# Altium project RP2040.PrjPcb
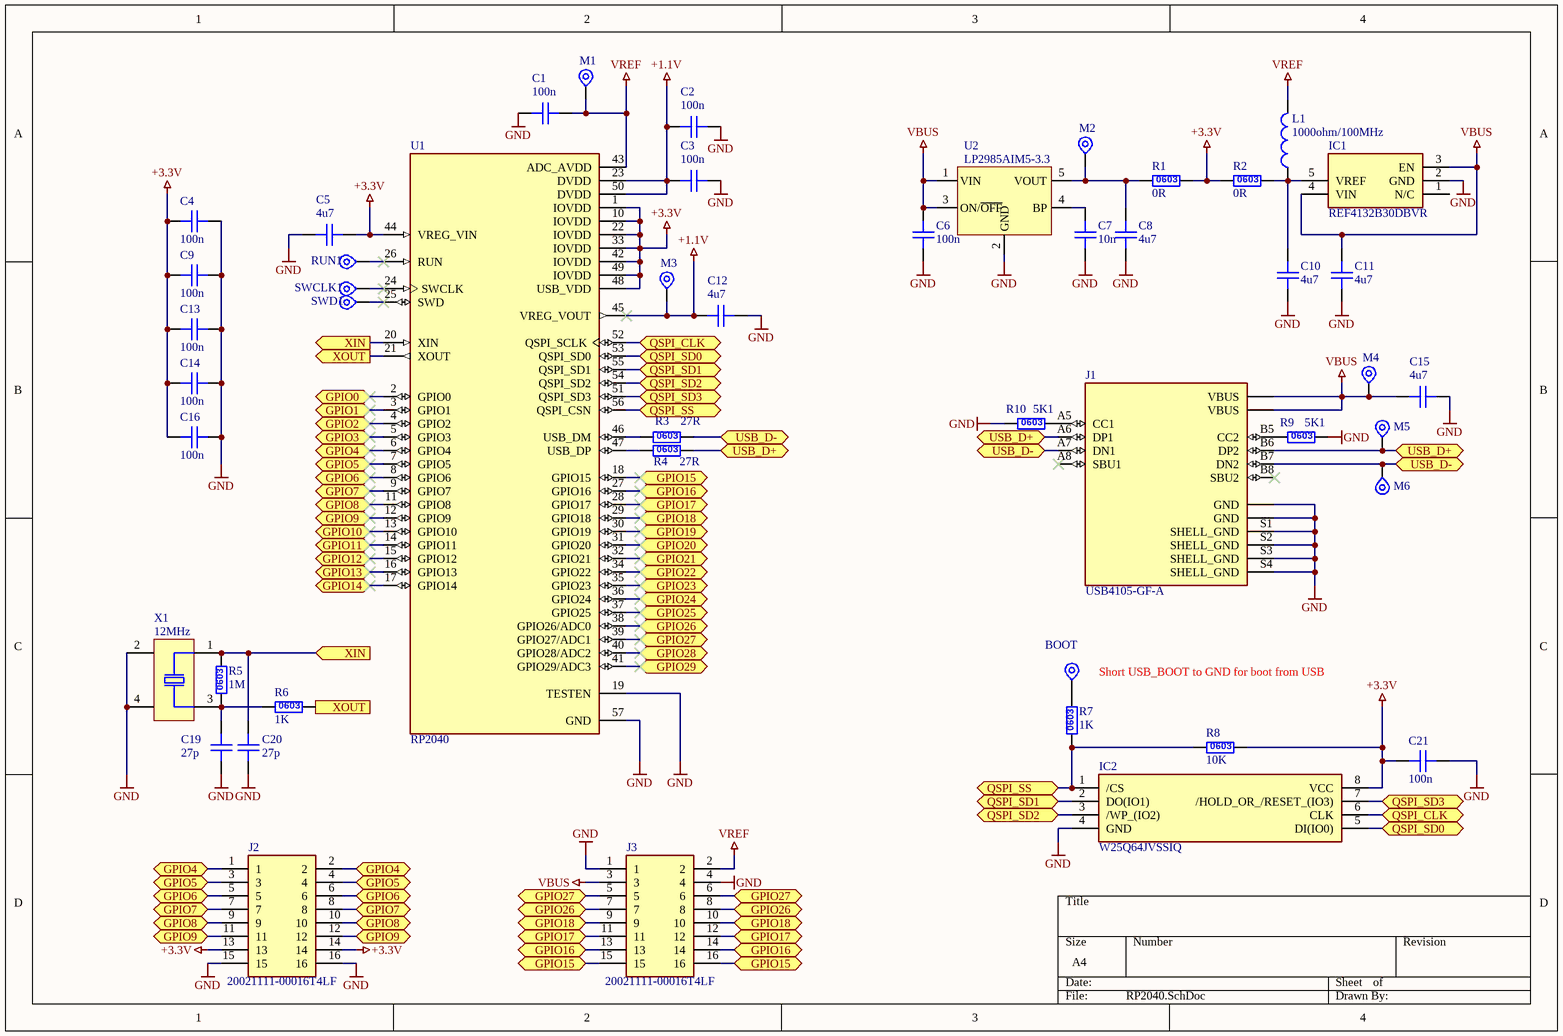
[diagram p0: RP2040.SchDoc]
=Title: RP2040
1 sheet, 48 parts. Net scope: flat (ports and power ports of the same name join across sheets).
Board file: RP2040.PcbDoc

## Sheet RP2040.SchDoc
size A4; SheetNumber: 1; SheetTotal: 1

### Parts
BOOT  TP  [Pad0.6mm]  (value not drawn)  (no BOM)
C1  100n  [C0603M]
C2  100n  [C0603M]
C3  100n  [C0603M]
C4  100n  [C0603M]
C5  4u7  [C0603]
C6  100n  [C0603M]
C7  10n  [C0603M]
C8  4u7  [C0603]
C9  100n  [C0603M]
C10  4u7  [C0603]
C11  4u7  [C0603]
C12  4u7  [C0603]
C13  100n  [C0603M]
C14  100n  [C0603M]
C15  4u7  [C0603]
C16  100n  [C0603M]
C19  27p  [C0603M]
C20  27p  [C0603M]
C21  100n  [C0603M]
IC1  REF4132B30DBVR  [SOT95P280X145-5N]
IC2  W25Q64JVSSIQ  [SOIC127P790X216-8N]
J1  USB4105-GF-A  [GCT_USB4105-GF-A]
J2  20021111-00016T4LF  [2002111100016T4LF]
J3  20021111-00016T4LF  [2002111100016T4LF]
L1  1000ohm/100MHz  [L0805M]
M1  TP  [Pad 1mm SMD]  (value not drawn)  (no BOM)
M2  TP  [Pad 1mm SMD]  (value not drawn)  (no BOM)
M3  TP  [Pad 1mm SMD]  (value not drawn)  (no BOM)
M4  TP  [Pad 1mm SMD]  (value not drawn)  (no BOM)
M5  TP  [Pad 1mm SMD]  (value not drawn)  (no BOM)
M6  TP  [Pad 1mm SMD]  (value not drawn)  (no BOM)
R1  0R  [R0603]
R2  0R  [R0603]
R3  27R  [R0603]
R4  27R  [R0603]
R5  1M  [R0603]
R6  1K  [R0603]
R7  1K  [R0603]
R8  10K  [R0603]
R9  5K1  [R0603]
R10  5K1  [R0603]
RUN1  TP  [Pad0.6mm]  (value not drawn)  (no BOM)
SWCLK1  TP  [Pad0.6mm]  (value not drawn)  (no BOM)
SWD1  TP  [Pad0.6mm]  (value not drawn)  (no BOM)
U1  RP2040  [QFN40P700X700X90-57N]
U2  LP2985AIM5-3.3  [SOT23-5]
X1  12MHz  [XTAL_SMD_5032_4PIN]

### Ports
GPIO0 (bidir), GPIO1 (bidir), GPIO2 (bidir), GPIO3 (bidir), GPIO4 (bidir), GPIO5 (bidir), GPIO6 (bidir), GPIO7 (bidir), GPIO8 (bidir), GPIO9 (bidir), GPIO10 (bidir), GPIO11 (bidir), GPIO12 (bidir), GPIO13 (bidir), GPIO14 (bidir), GPIO15 (bidir), GPIO16 (bidir), GPIO17 (bidir), GPIO18 (bidir), GPIO19 (bidir), GPIO20 (bidir), GPIO21 (bidir), GPIO22 (bidir), GPIO23 (bidir), GPIO24 (bidir), GPIO25 (bidir), GPIO26 (bidir), GPIO27 (bidir), GPIO28 (bidir), GPIO29 (bidir), QSPI_CLK (bidir), QSPI_SD0 (bidir), QSPI_SD1 (bidir), QSPI_SD2 (bidir), QSPI_SD3 (bidir), QSPI_SS (bidir), USB_D+ (bidir), USB_D- (bidir), XIN (in), XIN (out), XOUT (out)

### Nets
+1.1V: C2.1 C3.1 C12.1 M3.1 U1.23(DVDD) U1.45(VREG_VOUT) U1.50(DVDD)
+3.3V: C4.2 C5.2 C9.2 C13.2 C14.2 C16.2 C21.1 IC2.8(VCC) J2.13 J2.14 R1.1 R2.2 R8.1 U1.1(IOVDD) U1.10(IOVDD) U1.22(IOVDD) U1.33(IOVDD) U1.42(IOVDD) U1.44(VREG_VIN) U1.48(USB_VDD) U1.49(IOVDD)
GND: C1.2 C2.2 C3.2 C4.1 C5.1 C6.2 C7.2 C8.2 C9.1 C10.2 C11.2 C12.2 C13.1 C14.1 C15.2 C16.1 C19.2 C20.2 C21.2 IC1.2(GND) IC2.4(GND) J1.A1_B12(GND) J1.B1_A12(GND) J1.S1(SHELL_GND) J1.S2(SHELL_GND) J1.S3(SHELL_GND) J1.S4(SHELL_GND) J2.15 J2.16 J3.1 J3.4 R9.1 R10.2 U1.19(TESTEN) U1.57(GND) U2.2(GND) X1.2(Add2) X1.4(Add4)
VBUS: C6.1 C11.1 C15.1 IC1.3(EN) IC1.4(VIN) J1.A4_B9(VBUS) J1.B4_A9(VBUS) J3.3 M4.1 U2.1(VIN) U2.3(ON/~{OFF})
VREF: C1.1 J3.2 L1.2 M1.1 U1.43(ADC_AVDD)
NetBOOT_1: BOOT.1 R7.1
NetC7_1: C7.1 U2.4(BP)
NetC8_1: C8.1 M2.1 R1.2 U2.5(VOUT)
NetC10_1: C10.1 IC1.5(VREF) L1.1 R2.1
NetC19_1: C19.1 R5.2 R6.2 X1.3(Osc3)
NetC20_1: C20.1 R5.1 U1.20(XIN) X1.1(Osc1) ; port XIN
NetIC2_1: IC2.1(/CS) R7.2 R8.2 U1.56(QSPI_CSN) ; port QSPI_SS
NetIC2_2: IC2.2(DO(IO1)) U1.55(QSPI_SD1) ; port QSPI_SD1
NetIC2_3: IC2.3(/WP_(IO2)) U1.54(QSPI_SD2) ; port QSPI_SD2
NetIC2_5: IC2.5(DI(IO0)) U1.53(QSPI_SD0) ; port QSPI_SD0
NetIC2_6: IC2.6(CLK) U1.52(QSPI_SCLK) ; port QSPI_CLK
NetIC2_7: IC2.7(/HOLD_OR_/RESET_(IO3)) U1.51(QSPI_SD3) ; port QSPI_SD3
NetJ1_A5: J1.A5(CC1) R10.1
NetJ1_A6: J1.A6(DP1) J1.B6(DP2) M5.1 R4.1 ; port USB_D+
NetJ1_A7: J1.A7(DN1) J1.B7(DN2) M6.1 R3.1 ; port USB_D-
NetJ1_B5: J1.B5(CC2) R9.2
NetJ2_1: J2.1 J2.2 U1.6(GPIO4) ; port GPIO4
NetJ2_3: J2.3 J2.4 U1.7(GPIO5) ; port GPIO5
NetJ2_5: J2.5 J2.6 U1.8(GPIO6) ; port GPIO6
NetJ2_7: J2.7 J2.8 U1.9(GPIO7) ; port GPIO7
NetJ2_9: J2.9 J2.10 U1.11(GPIO8) ; port GPIO8
NetJ2_11: J2.11 J2.12 U1.12(GPIO9) ; port GPIO9
NetJ3_5: J3.5 J3.6 U1.39(GPIO27/ADC1) ; port GPIO27
NetJ3_7: J3.7 J3.8 U1.38(GPIO26/ADC0) ; port GPIO26
NetJ3_9: J3.9 J3.10 U1.29(GPIO18) ; port GPIO18
NetJ3_11: J3.11 J3.12 U1.28(GPIO17) ; port GPIO17
NetJ3_13: J3.13 J3.14 U1.27(GPIO16) ; port GPIO16
NetJ3_15: J3.15 J3.16 U1.18(GPIO15) ; port GPIO15
NetR3_2: R3.2 U1.46(USB_DM)
NetR4_2: R4.2 U1.47(USB_DP)
NetR6_1: R6.1 U1.21(XOUT) ; port XOUT
NetRUN1_1: RUN1.1 U1.26(RUN)
NetSWCLK1_1: SWCLK1.1 U1.24(SWCLK)
NetSWD1_1: SWD1.1 U1.25(SWD)
NetU1_2: U1.2(GPIO0) ; port GPIO0
NetU1_3: U1.3(GPIO1) ; port GPIO1
NetU1_4: U1.4(GPIO2) ; port GPIO2
NetU1_5: U1.5(GPIO3) ; port GPIO3
NetU1_13: U1.13(GPIO10) ; port GPIO10
NetU1_14: U1.14(GPIO11) ; port GPIO11
NetU1_15: U1.15(GPIO12) ; port GPIO12
NetU1_16: U1.16(GPIO13) ; port GPIO13
NetU1_17: U1.17(GPIO14) ; port GPIO14
NetU1_30: U1.30(GPIO19) ; port GPIO19
NetU1_31: U1.31(GPIO20) ; port GPIO20
NetU1_32: U1.32(GPIO21) ; port GPIO21
NetU1_34: U1.34(GPIO22) ; port GPIO22
NetU1_35: U1.35(GPIO23) ; port GPIO23
NetU1_36: U1.36(GPIO24) ; port GPIO24
NetU1_37: U1.37(GPIO25) ; port GPIO25
NetU1_40: U1.40(GPIO28/ADC2) ; port GPIO28
NetU1_41: U1.41(GPIO29/ADC3) ; port GPIO29

Not connected (* = marked no-connect by the designer): IC1 1(N/C); J1 A8(SBU1)* B8(SBU2)*

### Notes on the sheet
- Short USB_BOOT to GND for boot from USB
- (in symbol CMP-UN-002043-2) 0603
- (in symbol UniversalResistor) 0603

### Library data of the parts
BOOT M1-M6 RUN1 SWCLK1 SWD1 = M Point: Test Point; Main: Mechanical; Category: Pads_Pins_Measure_Points; Stock number: --------
C1-C4 C6 C9 C13 C14 C16 C21 = UniversalCapacitor: Ceramic Capacitor X7R; Manufacturer: VISHAY; Part Number: 100n/16V X7R C0603; Main: Capacitors; SMD/THD: SMD; Value: 100n/16V; Stock number: 10003450; Category: Capacitors CERA SMD; Status: X
C5 C10-C12 C15 = UniversalCapacitor: Ceramic Capacitor X5R; Part Number: GRM188R60J475KE19J; Manufacturer: Murata; Value: 4u7/6,3V; SMD/THD: SMD; Main: Capacitors; Category: Capacitors CERA SMD; Stock number: 10006168; Status: T; ComponentLink1URL: http://datasheet.octopart.com/GRM188R60J475KE19J-Murata-datasheet-14401031.pdf; ComponentLink1Description: Datasheet
C7 = UniversalCapacitor: Ceramic Capacitor X7R; Manufacturer: VISHAY; Part Number: 10n/50V X7R C0603; SMD/THD: SMD; Main: Capacitors; Status: A; Stock number: 10002497; Category: Capacitors CERA SMD; Value: 10n
C8 = CMP-UN-000401-1: Ceramic Capacitor X5R; Part Number: GRM188R60J475KE19J; Manufacturer: Murata; Value: 4u7/6,3V; SMD/THD: SMD; Main: Capacitors; Category: Capacitors CERA SMD; Stock number: 10006168; Status: T; ComponentLink1URL: http://datasheet.octopart.com/GRM188R60J475KE19J-Murata-datasheet-14401031.pdf; ComponentLink1Description: Datasheet
C19 C20 = UniversalCapacitor: Ceramic Capacitor NPO; Manufacturer: VISHAY; Part Number: 22p/50V NPO C0603; Main: Capacitors; SMD/THD: SMD; Value: 22p; Stock number: 10004609; Status: A; Category: Capacitors CERA SMD
IC1 = REF4132B30DBVR: Integrated Circuit; Manufacturer_Name: Texas Instruments; Datasheet Link: https://www.ti.com/lit/ds/symlink/ref4132.pdf?ts=1621337373445&ref_url=https%253A%252F%252Fwww.ti.com%252Fstore%252Fti%252Fen%252Fp%252Fproduct%252F%253Fp%253DREF4132B33DBVR; Height: 1.45mm; Manufacturer_Part_Number: REF4132B30DBVR
IC2 = W25Q64JVSSIQ: Integrated Circuit; Manufacturer_Name: Winbond; Datasheet Link: https://componentsearchengine.com//W25Q64JVSSIQ.pdf; Height: 2.16mm; Mouser2 Part Number: 454-W25Q64JVSSIQ; Mouser2 Price/Stock: https://www.mouser.com/Search/Refine.aspx?Keyword=454-W25Q64JVSSIQ; Manufacturer_Part_Number: W25Q64JVSSIQ
J1 = USB4105-GF-A: USB-C (USB TYPE-C) USB 2.0 Receptacle Connector 24 (16+8 Dummy) Position Surface Mount, Right Angle; Through Hole; MF: GCT; Price: None; Value: *; MP: USB4105-GF-A; Package: None; Purchase-URL: https://pricing.snapeda.com/search/part/USB4105-GF-A/?ref=eda; SnapEDA_Link: https://www.snapeda.com/parts/USB4105-GF-A/Global%20Connector%20Technology/view-part/4423780/?ref=snap; Check_prices: https://www.snapeda.com/parts/USB4105-GF-A/Global%20Connector%20Technology/view-part/4423780/?ref=eda; Availability: Warning
J2 J3 = 20021111-00016T4LF: Connector; Manufacturer_Name: Amphenol; Datasheet Link: https://cdn.amphenol-icc.com/media/wysiwyg/files/drawing/20021111.pdf; Height: 5.5mm; Manufacturer_Part_Number: 20021111-00016T4LF
L1 = UniversalInductor: Ferrite Bead (10 to 200MHz) 0.5A; Manufacturer: TDK; Part Number: MMZ2012R102A; Main: Inductors; SMD/THD: SMD; ComponentLink1Description: Datasheet; Category: Ferrite Beads; ComponentLink1URL: http://www.farnell.com/datasheets/84901.pdf; Value: 1000ohm/100MHz; Status: A; Stock number: 10005111
R1 = CMP-UN-002043-2: Resistor 1%, 0.1W, 75V; Part Number: 0R R0603; Manufacturer: VISHAY; SMD/THD: SMD; Main: Resistors; Stock number: 10005433; Value: 0R; Category: Resistors SMD; Status: A
R2 = UniversalResistor: Resistor 1%, 0.1W, 75V; Part Number: 0R R0603; Manufacturer: VISHAY; SMD/THD: SMD; Main: Resistors; Stock number: 10005433; Value: 0R; Category: Resistors SMD; Status: A
R3 R4 = UniversalResistor: Resistor 1%, 0.1W, 75V; Manufacturer: YAGEO (PHYCOMP); Part Number: 27R R0603; SMD/THD: SMD; Main: Resistors; Category: Resistors SMD; Value: 27R; Status: A; Stock number: 10005475
R5 = UniversalResistor: Resistor 1%, 0.1W, 75V; Manufacturer: VISHAY; Part Number: 1M0 R0603; SMD/THD: SMD; Main: Resistors; Stock number: 10004745; Status: A; Category: Resistors SMD; Value: 1M
R6 R7 R9 R10 = UniversalResistor: Resistor 1%, 0.1W, 75V; Manufacturer: VISHAY; Part Number: 1K R0603; SMD/THD: SMD; Main: Resistors; Status: A; Category: Resistors SMD; Stock number: 10004641
  R6 R7: Value: 1K
  R9 R10: Value: 5K1
R8 = UniversalResistor: Resistor 1%, 0.1W, 75V; Part Number: 10K R0603; Manufacturer: VISHAY; Main: Resistors; SMD/THD: SMD; Stock number: 10004622; Value: 10K; Category: Resistors SMD; Status: A
U1 = RP2040: RP2040 Raspberry Pi Pico - ARMÂ® CortexÂ®-M0+ MCU 32-Bit Embedded Evaluation Board; Price: None; SnapEDA_Link: https://www.snapeda.com/parts/RP2040/Raspberry%20Pi/view-part/5800506/?ref=snap; Purchase-URL: https://pricing.snapeda.com/search/part/RP2040/?ref=eda; Check_prices: https://www.snapeda.com/parts/RP2040/Raspberry%20Pi/view-part/5800506/?ref=eda; MF: Raspberry Pi; Value: *; MP: RP2040; Package: Package; Availability: In Stock
U2 = LP2985_SOT25: 150-mA , Low-Dropout Regulator; Manufacturer: Texas Instruments; Part Number: LP2985AIM5-3.3/NOPB; SMD/THD: SMD; Main: IC's; Value: LP2985AIM5-3.3; Category: Voltage Regulators; Stock number: 10006099; ComponentLink1Description: Datasheet; Status: N; ComponentLink1URL: http://www.farnell.com/datasheets/1972829.pdf
X1 = Symbol: Crystal Resonator; Manufacturer: Geyer; Part Number: 12.000MHz KX-9A; Main: Crystals; Category: Crystals; Value: 12MHz